# EAGLE design DRV_04_25_2017 (EAGLE 6.6.0)
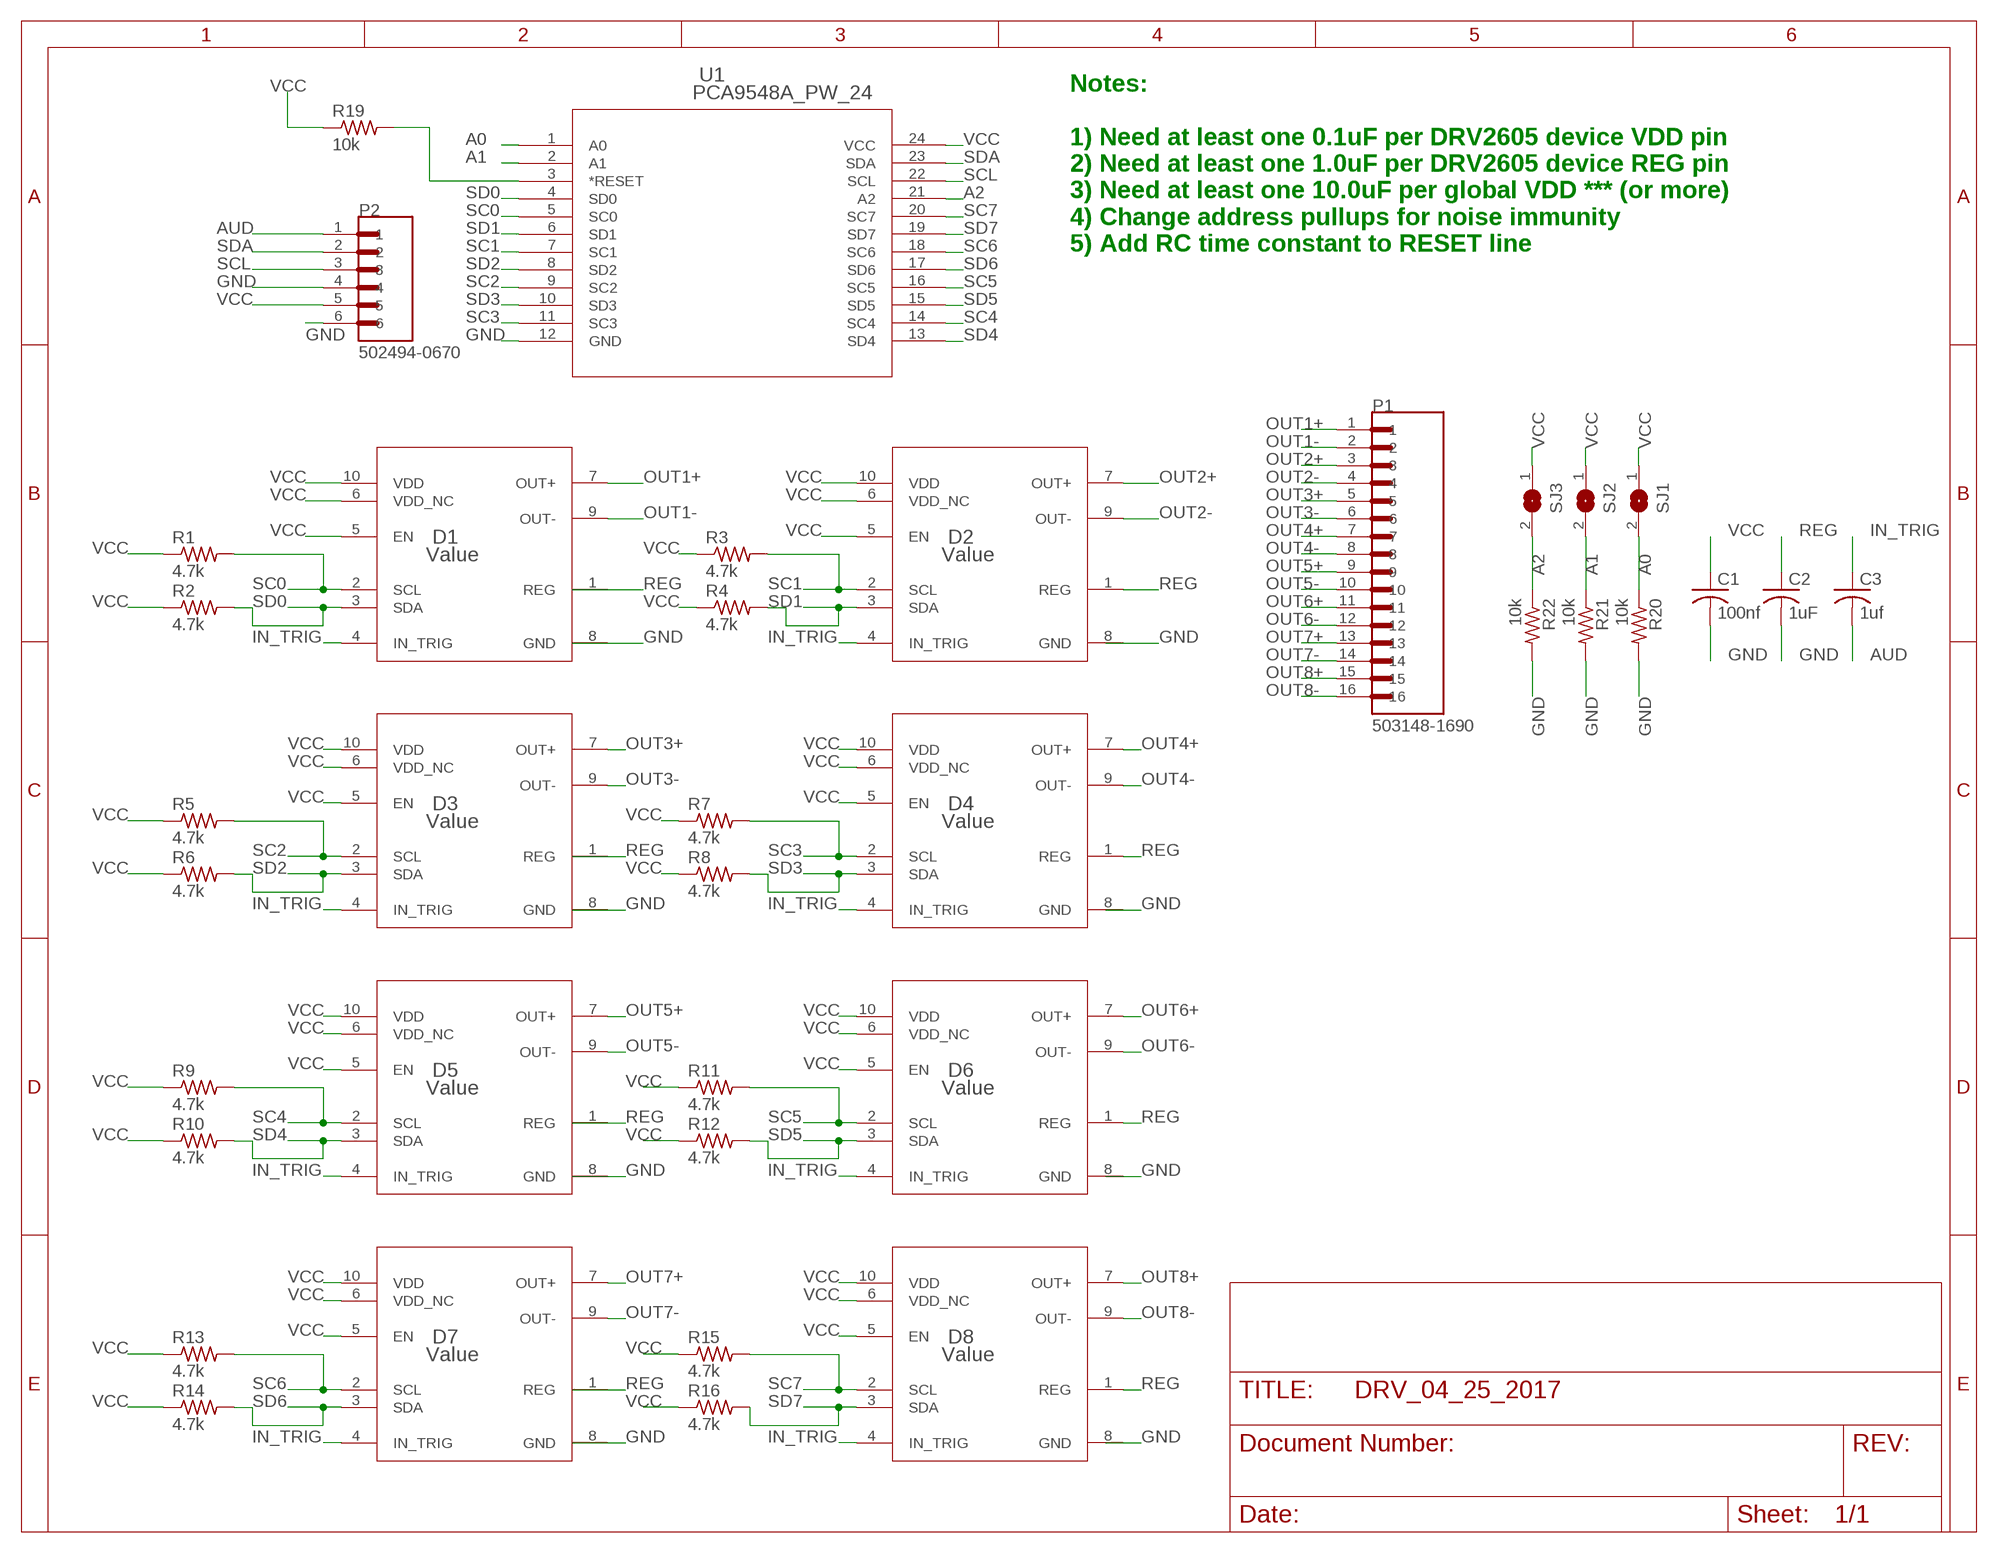
[diagram p0: schematic, sheet 1]

## Parts
C1  100nf  C-USC0603  [C0603]
C2  1uF  C-USC0603  [C0603]
C3  1uf  C-USC0603  [C0603]
D1  Value  DRV2605LDGSR  [DGS0010A]
D2  Value  DRV2605LDGSR  [DGS0010A]
D3  Value  DRV2605LDGSR  [DGS0010A]
D4  Value  DRV2605LDGSR  [DGS0010A]
D5  Value  DRV2605LDGSR  [DGS0010A]
D6  Value  DRV2605LDGSR  [DGS0010A]
D7  Value  DRV2605LDGSR  [DGS0010A]
D8  Value  DRV2605LDGSR  [DGS0010A]
P1  503148-1690  [MOLEX_503148-1690]
P2  502494-0670  [MOLEX_502494-0670]
R1  4.7k  R-US_R0402  [R0402]
R2  4.7k  R-US_R0402  [R0402]
R3  4.7k  R-US_R0402  [R0402]
R4  4.7k  R-US_R0402  [R0402]
R5  4.7k  R-US_R0402  [R0402]
R6  4.7k  R-US_R0402  [R0402]
R7  4.7k  R-US_R0402  [R0402]
R8  4.7k  R-US_R0402  [R0402]
R9  4.7k  R-US_R0402  [R0402]
R10  4.7k  R-US_R0402  [R0402]
R11  4.7k  R-US_R0402  [R0402]
R12  4.7k  R-US_R0402  [R0402]
R13  4.7k  R-US_R0402  [R0402]
R14  4.7k  R-US_R0402  [R0402]
R15  4.7k  R-US_R0402  [R0402]
R16  4.7k  R-US_R0402  [R0402]
R19  10k  R-US_R0402  [R0402]
R20  10k  R-US_R0402  [R0402]
R21  10k  R-US_R0402  [R0402]
R22  10k  R-US_R0402  [R0402]
SJ1  SJ  [SJ]
SJ2  SJ  [SJ]
SJ3  SJ  [SJ]
U1  PCA9548A_PW_24  [PW24]

## Nets
A0: R20.1 SJ1.2 U1.1(A0)
A1: R21.1 SJ2.2 U1.2(A1)
A2: R22.1 SJ3.2 U1.21(A2)
AUD: C3.2 P2.1
GND: C1.2 C2.2 D1.8(GND) D2.8(GND) D3.8(GND) D4.8(GND) D5.8(GND) D6.8(GND) D7.8(GND) D8.8(GND) P2.4 P2.6 R20.2 R21.2 R22.2 U1.12(GND)
IN_TRIG: C3.1 D1.4(IN_TRIG) D2.4(IN_TRIG) D3.4(IN_TRIG) D4.4(IN_TRIG) D5.4(IN_TRIG) D6.4(IN_TRIG) D7.4(IN_TRIG) D8.4(IN_TRIG)
OUT1+: D1.7(OUT+) P1.1
OUT1-: D1.9(OUT-) P1.2
OUT2+: D2.7(OUT+) P1.3
OUT2-: D2.9(OUT-) P1.4
OUT3+: D3.7(OUT+) P1.5
OUT3-: D3.9(OUT-) P1.6
OUT4+: D4.7(OUT+) P1.7
OUT4-: D4.9(OUT-) P1.8
OUT5+: D5.7(OUT+) P1.9
OUT5-: D5.9(OUT-) P1.10
OUT6+: D6.7(OUT+) P1.11
OUT6-: D6.9(OUT-) P1.12
OUT7+: D7.7(OUT+) P1.13
OUT7-: D7.9(OUT-) P1.14
OUT8+: D8.7(OUT+) P1.15
OUT8-: D8.9(OUT-) P1.16
REG: C2.1 D1.1(REG) D2.1(REG) D3.1(REG) D4.1(REG) D5.1(REG) D6.1(REG) D7.1(REG) D8.1(REG)
RESET: R19.2 U1.3(*RESET)
SC0: D1.2(SCL) R1.2 U1.5(SC0)
SC1: D2.2(SCL) R3.2 U1.7(SC1)
SC2: D3.2(SCL) R5.2 U1.9(SC2)
SC3: D4.2(SCL) R7.2 U1.11(SC3)
SC4: D5.2(SCL) R9.2 U1.14(SC4)
SC5: D6.2(SCL) R11.2 U1.16(SC5)
SC6: D7.2(SCL) R13.2 U1.18(SC6)
SC7: D8.2(SCL) R15.2 U1.20(SC7)
SCL: P2.3 U1.22(SCL)
SD0: D1.3(SDA) R2.2 U1.4(SD0)
SD1: D2.3(SDA) R4.2 U1.6(SD1)
SD2: D3.3(SDA) R6.2 U1.8(SD2)
SD3: D4.3(SDA) R8.2 U1.10(SD3)
SD4: D5.3(SDA) R10.2 U1.13(SD4)
SD5: D6.3(SDA) R12.2 U1.15(SD5)
SD6: D7.3(SDA) R14.2 U1.17(SD6)
SD7: D8.3(SDA) R16.2 U1.19(SD7)
SDA: P2.2 U1.23(SDA)
VCC: C1.1 D1.5(EN) D1.6(VDD_NC) D1.10(VDD) D2.5(EN) D2.6(VDD_NC) D2.10(VDD) D3.5(EN) D3.6(VDD_NC) D3.10(VDD) D4.5(EN) D4.6(VDD_NC) D4.10(VDD) D5.5(EN) D5.6(VDD_NC) D5.10(VDD) D6.5(EN) D6.6(VDD_NC) D6.10(VDD) D7.5(EN) D7.6(VDD_NC) D7.10(VDD) D8.5(EN) D8.6(VDD_NC) D8.10(VDD) P2.5 R1.1 R2.1 R3.1 R4.1 R5.1 R6.1 R7.1 R8.1 R9.1 R10.1 R11.1 R12.1 R13.1 R14.1 R15.1 R16.1 R19.1 SJ1.1 SJ2.1 SJ3.1 U1.24(VCC)

## Notes on the sheet
- Notes:
  
  1) Need at least one 0.1uF per DRV2605 device VDD pin
  2) Need at least one 1.0uF per DRV2605 device REG pin
  3) Need at least one 10.0uF per global VDD *** (or more)
  4) Change address pullups for noise immunity
  5) Add RC time constant to RESET line

## Library data of the parts
C1-C3 = rcl:C-US: CAPACITOR, American symbol
D1-D8 = DRV2605L_DGSR:DRV2605LDGSR; COMPTYPE: IC; MANUFACTURER: Texas Instruments; MOUNTTYPE: SMT; PACKAGEREFERENCE: DGS0010A; PARTNUMBER: DRV2605LDGS; PIN_COUNT: 10; REFDES: RefDes; ROHS: Y; TYPE: TYPE
P1 = 503148-1690:503148-1690: 1.50mm Pitch CLIK-Mate™ Wire-to-Board PCB Receptacle, Dual Row, Right Angle, 16 Circuits; AVAILABILITY: Good; DESCRIPTION: 1.50mm Pitch CLIK-Mate™ Wire-to-Board PCB Receptacle, Dual Row, Right Angle, 16 Circuits; MF: Molex; MP: 503148-1690; PACKAGE: None; PRICE: 1.51 USD
P2 = 502494-0670:502494-0670: 2.00mm Pitch CLIK-Mate™ Wire-to-Board PCB Receptacle, Single Row, Right Angle, 6 Circuits; AVAILABILITY: Good; DESCRIPTION: 2.00mm Pitch CLIK-Mate™ Wire-to-Board PCB Receptacle, Single Row, Right Angle, 6 Circuits; MF: Molex; MP: 502494-0670; PACKAGE: None; PRICE: 0.53 USD
R1-R16 R19-R22 = resistor:R-US_: RESISTOR, American symbol
SJ1-SJ3 = jumper:SJ: SMD solder JUMPER
U1 = PCA9548A_PW_124:PCA9548A_PW_24; DATASHEETURL: http://www.ti.com/lit/gpn/PCA9548A; DESCRIPTION: 8-Channel I2C Switch With Reset; FAMILY_NAME: I2C MULTIPLEXER, SWITCH; GENERIC_PART_NUMBER: PCA9548A; INDUSTRY_STD_PKG_TYPE: TSSOP; MANUFACTURER: Texas Instruments; MANUFACTURER_PART_NUMBER: pca9548a_pw_24; PACKAGE_DESIGNATOR: PW; PIN_COUNT: 24; VENDOR: Texas Instruments

## Net classes
0 default: width 0.1 mm, drill 0.185 mm, clearance 0.1 mm

## Board
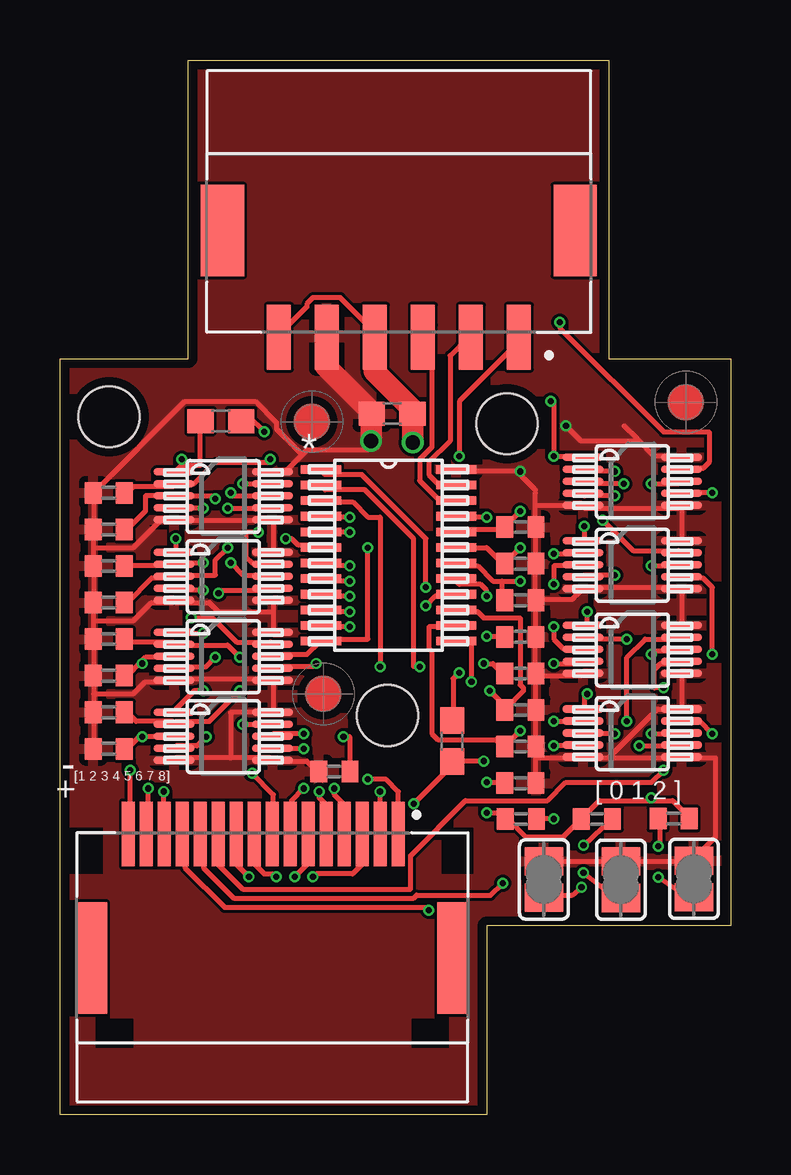
[diagram p1: board, top side]
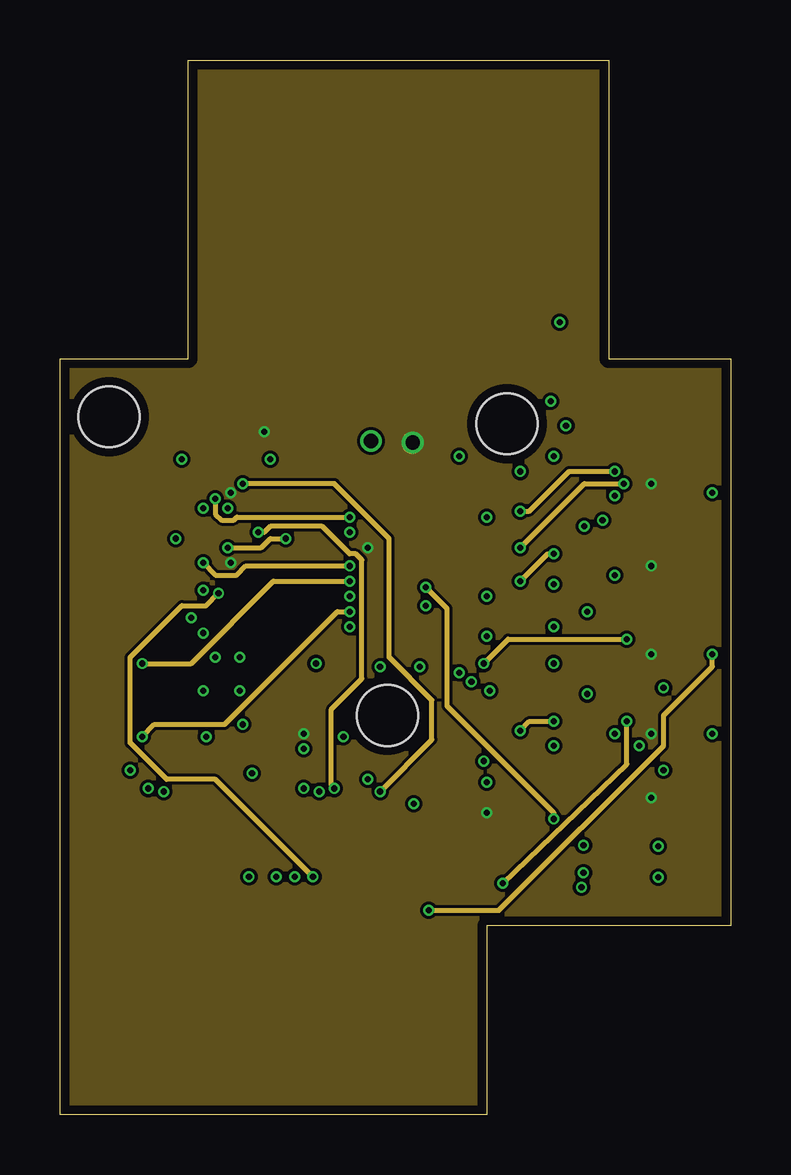
[diagram p2: board, inner layer Route2]
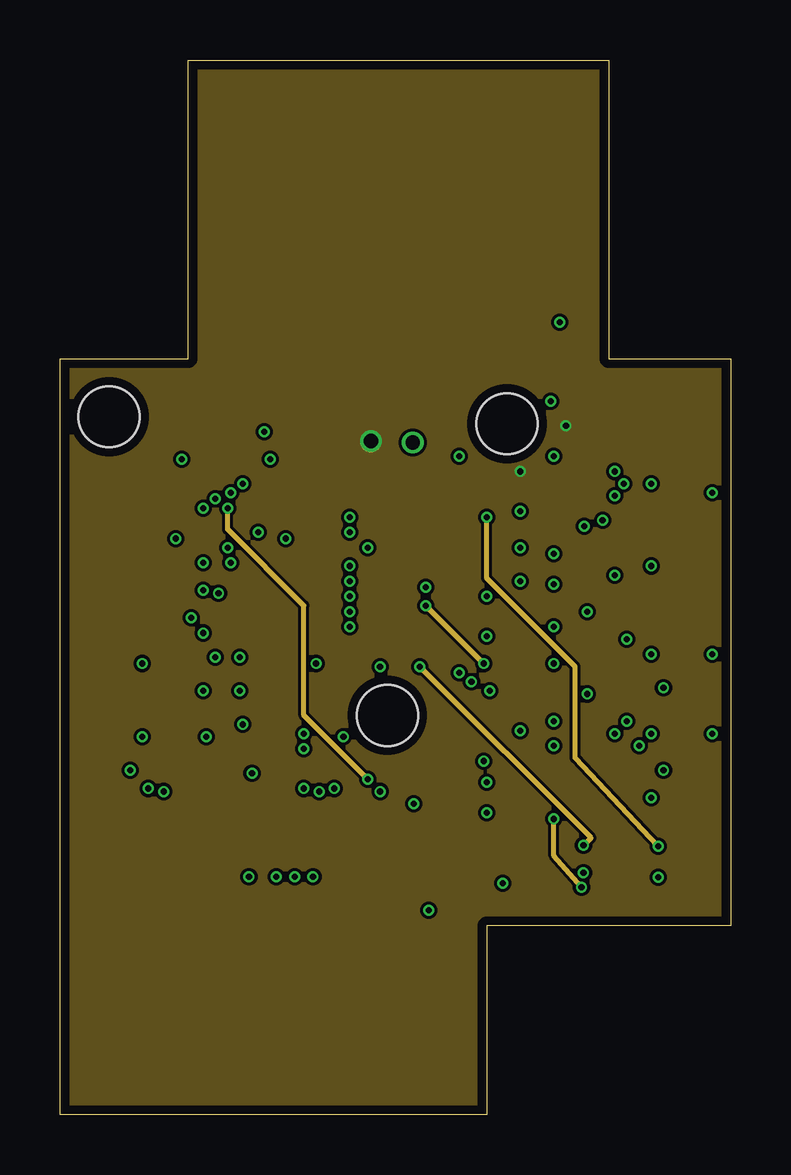
[diagram p3: board, inner layer Route15]
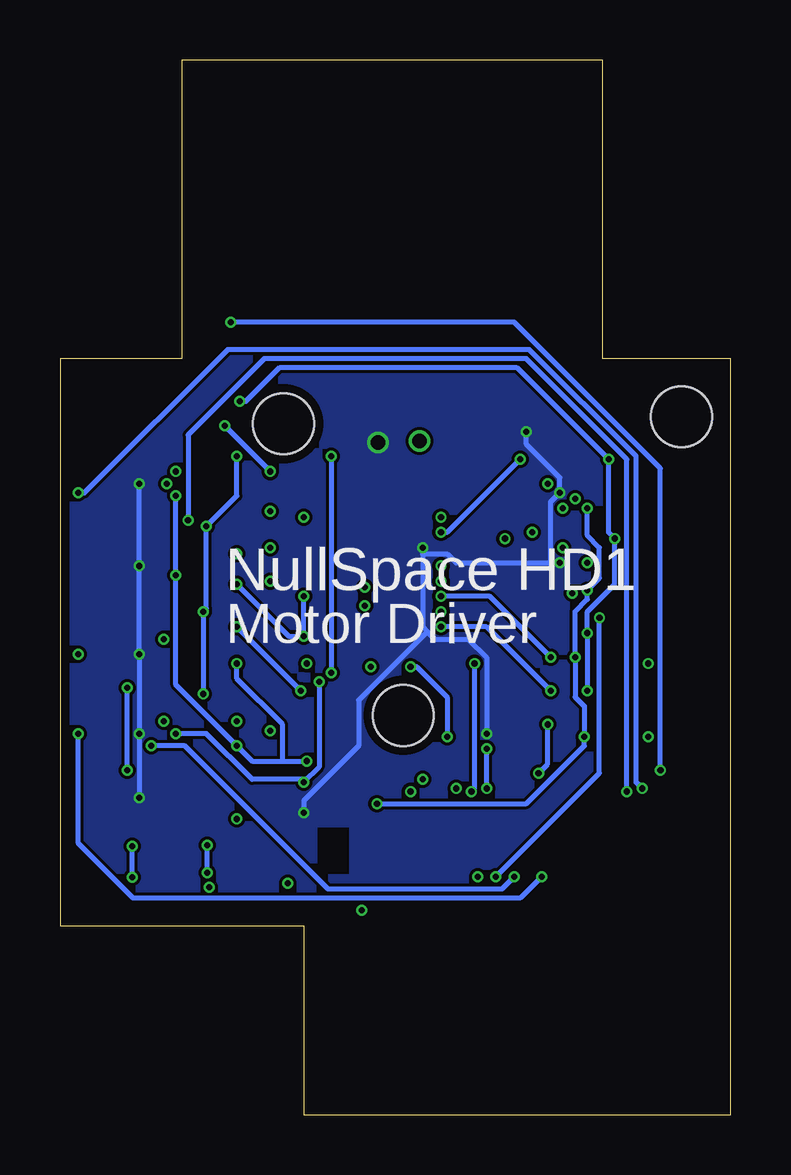
[diagram p4: board, bottom side, seen from below]

Size 27.94 x 43.94 mm. Coordinates in mm from the lower left corner, seen from the top.
Outline: 5.33,31.5 5.33,43.94 22.86,43.94 22.86,31.5 27.94,31.5 27.94,7.87 17.78,7.87 17.78,0 0,0 0,31.5 5.33,31.5
Copper layers (1*2*15*16): Top 0.035559375mm / dielectric 0.17018125mm / Route2 0.01778125mm / dielectric 47mil / Route15 0.01778125mm / dielectric 0.17018125mm / Bottom 0.035559375mm
Design rules "OSHPark-4layer *": minimum track width 8mil, minimum drill 10mil, track to track 5mil, track to pad 5mil, pad to pad 5mil, via to via 5mil, smd to smd 5mil, copper to edge 15mil, drill to drill 6mil, minimum pad ring 4mil, minimum via ring 4mil, stop-mask expansion 2.5mil, vias tented up to drill 0mil, thermal gap 10mil
Holes 2.54 mm at 2.05,29.08 18.63,28.79 13.64,16.64

### Footprints (pad centres in the part's own frame; a part is rotated, then mirrored left to right if it is on the bottom)
C0603 = smd 1.1 x 1: 1 -0.85,0; 2 0.85,0
DGS0010A = smd 1.702 x 0.305: 1 -2.05,1; 2 -2.05,0.5; 3 -2.05,0; 4 -2.05,-0.5; 5 -2.05,-1; 6 2.05,-1; 7 2.05,-0.5; 8 2.05,0; 9 2.05,0.5; 10 2.05,1
MOLEX_503148-1690 = smd 0.55 x 2.7: 1 5.25,0; 2 4.5,0; 3 3.75,0; 4 3,0; 5 2.25,0; 6 1.5,0; 7 0.75,0; 8 0,0; 9 -0.75,0; 10 -1.5,0; 11 -2.25,0; 12 -3,0; 13 -3.75,0; 14 -4.5,0; 15 -5.25,0; 16 -6,0 | smd 1.2 x 4.65: P1 7.48,-5.175; P2 -7.48,-5.175
MOLEX_502494-0670 = smd 1 x 2.7: 1 -5,0; 2 -3,0; 3 -1,0; 4 1,0; 5 3,0; 6 5,0 | smd 1.8 x 3.8: P1 -7.35,-4.45; P2 7.35,-4.45
R0402 = smd 0.7 x 0.9: 1 -0.65,0; 2 0.65,0
SJ = smd 1.168 x 1.6: 1 -0.762,0; 2 0.762,0
PW24 = smd 1.676 x 0.356: 1 -2.819,3.575; 2 -2.819,2.925; 3 -2.819,2.275; 4 -2.819,1.625; 5 -2.819,0.975; 6 -2.819,0.325; 7 -2.819,-0.325; 8 -2.819,-0.975; 9 -2.819,-1.625; 10 -2.819,-2.275; 11 -2.819,-2.925; 12 -2.819,-3.575; 13 2.819,-3.575; 14 2.819,-2.925; 15 2.819,-2.275; 16 2.819,-1.625; 17 2.819,-0.975; 18 2.819,-0.325; 19 2.819,0.325; 20 2.819,0.975; 21 2.819,1.625; 22 2.819,2.275; 23 2.819,2.925; 24 2.819,3.575

### Placement (x,y rotation side)
C1  13.84,29.2 0 top
C2  6.7,28.9 0 top
C3  16.35,15.57 90 top
D1  6.8,25.78 0 top
D2  6.81,22.44 0 top
D3  6.8,19.1 0 top
D4  6.8,15.77 0 top
D5  23.85,15.9 0 top
D6  23.85,19.38 0 top
D7  23.85,22.91 0 top
D8  23.85,26.39 0 top
P1  8.85,11.7 0 top
P2  14.12,32.39 180 top
R1  2.03,25.91 0 top
R2  2.03,24.38 0 top
R3  2.03,22.86 0 top
R4  2.03,21.34 0 top
R5  2.03,19.81 0 top
R6  2.03,18.29 0 top
R7  2.03,16.76 0 top
R8  2.03,15.24 0 top
R9  19.19,15.34 180 top
R10  19.19,13.81 180 top
R11  19.19,18.38 180 top
R12  19.19,16.86 180 top
R13  19.19,21.43 180 top
R14  19.19,19.91 180 top
R15  19.19,24.48 180 top
R16  19.19,22.96 180 top
R19  11.43,14.3 0 top
R20  19.2,12.32 180 top
R21  22.37,12.32 180 top
R22  25.57,12.34 0 top
SJ1  20.16,9.8 270 top
SJ2  23.37,9.79 270 top
SJ3  26.41,9.82 270 top
U1  13.69,23.31 0 top
U$1  [FIDUCIAL_G15]  10.97,17.53 0 top
U$2  [FIDUCIAL_G15]  10.5,28.87 0 top
U$4  [FIDUCIAL_G15]  26.08,29.69 0 top

### Tracks (layer width: path | path; a pad name or v marks a point on that pad's centre or on a via)
A0  (via drill 0.25)
  Top 0.203: v20.57,12.32 19.94,12.32 R20.1 | v21.73,9.47 21.34,9.14 20.19,9.14 SJ1.2 | v15.24,21.97 15.24,24 12.57,26.67 11.05,26.67 10.92,26.8 U1.1
  Route2 0.203: v15.24,21.97 16.13,21.08 16.13,17.02 20.57,12.57 v20.57,12.32
  Route15 0.203: v20.57,12.32 20.57,10.8 v21.73,9.47
A1  (via drill 0.25)
  Top 0.203: v21.81,11.23 22.99,12.32 R21.1 | v21.81,10.08 22.99,9.14 23.37,9.14 SJ2.2 | v14.99,18.67 14.73,18.67 14.73,24 12.7,26.03 11.05,26.03 10.92,26.16 U1.2
  Route15 0.203: v14.99,18.67 22.13,11.53 v21.81,11.23
  Bottom 0.203: v21.81,10.08 v21.81,11.23
A2  (via drill 0.25)
  Top 0.203: v24.93,11.18 25.02,11.18 25.02,12.32 R22.1 | v24.92,9.9 26.04,9.14 26.29,9.14 SJ3.2 | v17.78,24.89 16.51,24.89 U1.21
  Route15 0.203: v17.78,24.89 17.78,22.35 21.46,18.67 21.46,14.86 v24.93,11.18
  Bottom 0.203: v24.92,9.9 v24.93,11.18
AUD  (via drill 0.25)
  Top 0.203: v16.64,18.42 16.38,18.16 16.38,16.51 C3.2 | v16.64,27.43 16.64,29.72 19.05,32.13 19.05,32.39 P2.1
  Bottom 0.203: v16.64,27.43 v16.64,18.42
GND  (via drill 0.25, 0.6)
  Top 0.203: 24.64,13.08 22.48,13.08 21.84,12.45 R21.2 20.96,11.56 19.43,11.56 18.67,12.32 R20.2 18.54,12.45 18.42,12.57 v17.78,12.57 | 24.64,13.08 25.53,13.08 26.16,12.45 R22.2 | v24.64,15.88 25.78,15.88 D5.8 | v24.64,19.18 24.77,19.3 25.78,19.3 D6.8 | v24.64,22.86 25.78,22.86 D7.8 | v24.64,26.29 25.78,26.29 D8.8 | v24.64,13.21 24.64,13.08 | 7.62,28.96 C2.2 7.87,29.08 v8.51,28.45 | D3.8 8.89,19.18 10.29,19.18 10.79,19.69 U1.12 10.92,19.81 12.83,19.81 v12.83,23.62 | v10.16,15.88 8.89,15.88 D4.8 | v7.11,22.99 7.62,22.48 8.76,22.48 D2.8 | D1.8 7.24,25.78 v7.11,25.91 | P2.6 9.14,32.51 10.29,33.66 10.29,33.78 10.54,34.04 11.68,34.04 12.95,32.77 P2.4
  Top 0.889: 13.09,30.98 P2.4 13.13,32.38 13.1,30.97 14.69,29.38 C1.2 14.7,29.19 v14.7,28
  Route2 0.889: v14.7,28 14.68,27.98 14.68,28.01
  Bottom 0.203: v24.64,26.29 v24.64,22.86 v24.64,19.18 v24.64,15.88 v24.64,13.21 | v10.16,15.88 10.16,19.05 10.92,19.81 12.32,19.81 12.64,20.13 | 12.64,20.13 12.83,20.32 12.83,23.37 | v12.83,23.62 12.83,23.37 | 7.49,22.99 11.43,22.99 11.81,23.37 12.83,23.37 | 7.49,22.99 v7.11,22.99 | 7.49,22.99 7.49,25.53 v7.11,25.91 7.11,26.54 8.51,27.94 v8.51,28.45 | v17.78,12.57 17.78,13.08 15.49,15.37 15.49,17.27 12.64,20.13
  pour Route2: -6.1,49.02 34.54,49.02 34.54,-4.32 -6.1,-4.32
  pour Bottom: -6.1,46.48 29.46,46.48 29.46,-1.78 -6.1,-1.78
IN_TRIG  (via drill 0.25)
  Top 0.203: v6.1,15.75 5.71,15.37 4.83,15.37 D4.4 | v6.48,19.05 6.1,18.67 4.83,18.67 D3.4 | v5.97,21.84 4.83,21.84 D2.4 | v5.97,25.27 4.83,25.27 D1.4 | v17.65,14.73 16.38,14.73 C3.1 16.38,14.61 v14.73,12.95 | v20.57,15.37 21.72,15.37 D5.4 | v20.57,18.8 21.72,18.8 D6.4 | v23.11,22.48 21.84,22.48 D7.4 | v23.11,25.78 21.84,25.78 D8.4
  Bottom 0.203: v5.97,25.27 5.97,24.13 5.46,23.62 5.46,22.35 v5.97,21.84 5.97,21.46 6.48,20.95 v6.48,19.05 6.48,17.4 6.1,17.02 v6.1,15.75 6.1,15.37 8.51,12.95 v14.73,12.95 | 18.67,14.73 19.94,14.73 v20.57,15.37 23.11,17.91 v23.11,22.48 v23.11,25.78 | 18.67,14.73 v17.65,14.73 | v20.57,18.8 20.57,18.16 18.67,16.26 18.67,14.73
OUT1+  (via drill 0.25)
  Top 0.203: v6.99,25.27 8.76,25.27 D1.7 | v12.83,13.97 13.59,13.97 14.1,13.46 14.1,11.81 P1.1
  Route15 0.203: v6.99,25.27 6.99,24.38 10.16,21.21 10.16,16.64 v12.83,13.97
OUT1-  (via drill 0.25)
  Top 0.203: v7.62,26.29 8.76,26.29 D1.9 | v13.34,13.46 13.34,11.81 P1.2
  Route2 0.203: v7.62,26.29 11.43,26.29 13.72,24 13.72,19.05 15.49,17.27 15.49,15.62 v13.34,13.46
OUT2+  (via drill 0.25)
  Top 0.203: v6.6,21.72 6.73,21.84 8.76,21.84 D2.7 | v10.54,9.91 10.67,10.03 12.19,10.03 12.57,10.41 12.57,11.68 P1.3
  Route2 0.203: v6.6,21.72 6.1,21.21 5.08,21.21 2.92,19.05 2.92,15.49 4.45,13.97 6.48,13.97 v10.54,9.91
OUT2-  (via drill 0.25)
  Top 0.203: v8.25,24.26 7.75,24.26 7.75,23.24 8,22.99 8.76,22.99 D2.9 | v11.43,13.59 11.43,13.33 11.81,12.95 11.81,11.81 P1.4
  Route2 0.203: v8.25,24.26 8.51,24.26 8.76,24.51 10.92,24.51 12.07,23.37 12.32,23.37 12.57,23.11 12.57,18.16 11.3,16.89 11.3,13.72 v11.43,13.59
OUT3+  (via drill 0.25)
  Top 0.203: v10.67,18.8 10.54,18.67 8.89,18.67 D3.7 | v10.79,13.46 10.79,13.21 11.05,12.95 11.05,11.81 P1.5
  Bottom 0.203: v10.67,18.8 10.67,13.59 v10.79,13.46
OUT3-  (via drill 0.25)
  Top 0.203: v5.46,20.7 6.35,20.7 7.37,19.69 8.76,19.69 D3.9 | v9.78,9.91 10.29,10.41 10.29,11.68 P1.6
  Bottom 0.203: v5.46,20.7 5.46,14.22 v9.78,9.91
OUT4+  (via drill 0.25)
  Top 0.203: v10.16,15.24 8.89,15.24 D4.7 | v10.16,13.59 9.65,13.08 9.65,11.81 P1.7
  Bottom 0.203: v10.16,13.59 v10.16,15.24
OUT4-  (via drill 0.25)
  Top 0.203: v7.62,16.26 8.76,16.26 D4.9 | v8,14.22 8.89,13.33 8.89,11.81 P1.8
  Bottom 0.203: v7.62,16.26 7.62,14.61 v8,14.22
OUT5+  (via drill 0.25)
  Top 0.203: v24.13,15.37 25.78,15.37 D5.7 | v9.02,9.91 8.89,10.03 8.51,10.03 8.13,10.41 8.13,11.68 P1.9
  Bottom 0.203: v24.13,15.37 22.73,15.37 16.76,9.4 9.53,9.4 v9.02,9.91
OUT5-  (via drill 0.25)
  Top 0.203: v27.18,15.88 26.67,16.38 25.91,16.38 D5.9 | v7.87,9.91 7.37,10.41 7.37,11.68 P1.10
  Bottom 0.203: v27.18,15.88 27.18,11.3 24.89,9.02 8.76,9.02 v7.87,9.91
OUT6+  (via drill 0.25)
  Top 0.203: v25.15,17.78 24.77,17.78 24.77,18.54 25.02,18.8 25.78,18.8 D6.7 | v25.15,14.35 24.64,13.84 21.08,13.84 20.32,13.08 16.89,13.08 14.61,10.8 14.61,9.4 7.62,9.4 6.6,10.41 P1.11
  Bottom 0.203: v25.15,14.35 v25.15,17.78
OUT6-  (via drill 0.25)
  Top 0.203: v23.62,16.38 23.62,19.05 24.38,19.81 25.78,19.81 D6.9 | v18.45,9.64 17.93,9.14 14.86,9.14 14.73,9.02 7.24,9.02 5.97,10.29 5.97,11.68 P1.12
  Route2 0.203: v23.62,16.38 23.62,14.61 v18.45,9.64
OUT7+  (via drill 0.25)
  Top 0.203: v27.18,19.18 27.18,21.97 26.8,22.35 25.91,22.35 D7.7 | v15.37,8.51 15.24,8.64 6.86,8.64 5.21,10.29 5.21,11.68 P1.13
  Route2 0.203: v27.18,19.18 27.18,18.67 25.15,16.64 25.15,15.37 18.29,8.51 v15.37,8.51
OUT7-  (via drill 0.25)
  Top 0.203: v22.61,24.77 23.88,23.5 25.78,23.5 D7.9 | v4.32,13.46 4.32,11.81 P1.14
  Bottom 0.203: v22.61,24.77 22.61,28.32 19.43,31.5 8.51,31.5 4.32,27.31 v4.32,13.46
OUT8+  (via drill 0.25)
  Top 0.203: v27.18,25.91 25.91,25.91 D8.7 | v3.68,13.59 3.68,11.81 P1.15
  Bottom 0.203: v27.18,25.91 26.92,25.91 20.96,31.88 8.38,31.88 3.94,27.43 3.94,13.84 v3.68,13.59
OUT8-  (via drill 0.25)
  Top 0.203: v20.83,33.02 20.83,32.77 25.15,28.45 27.05,28.45 27.05,27.18 26.8,26.92 25.91,26.92 D8.9 | v2.92,14.35 2.92,11.81 P1.16
  Bottom 0.203: v20.83,33.02 9.02,33.02 2.92,26.92 v2.92,14.35
REG  (via drill 0.25)
  Top 0.203: v21.97,17.53 21.84,17.53 21.84,17.02 D5.1 | v21.97,20.95 21.97,20.45 21.84,20.45 D6.1 | v21.84,24.51 21.84,24 D7.1 | D8.1 21.72,27.43 v20.57,27.43 20.57,29.72 v20.45,29.72 | 5.08,27.05 5.84,27.05 5.84,28.83 C2.1 | 5.08,27.05 4.83,26.8 D1.1 | v5.97,17.65 5.59,17.65 4.83,16.89 D4.1 | v5.97,20.07 4.83,20.07 D3.1 | v4.83,24 4.83,23.5 D2.1 | v5.08,27.31 5.08,27.05
  Bottom 0.203: v21.97,17.53 v21.97,20.95 21.84,21.08 v21.84,24.51 20.57,25.78 v20.57,27.43 | v5.97,17.65 v5.97,20.07 5.97,20.95 4.83,22.1 v4.83,24 5.08,24.26 v5.08,27.31 8.89,31.11 18.8,31.11 20.19,29.72 v20.45,29.72
RESET  (via drill 0.25)
  Top 0.203: v11.81,15.75 12.07,15.75 12.07,14.35 R19.2 | v13.34,18.67 13.34,24.89 12.83,24.89 12.19,25.53 10.92,25.53 U1.3
  Bottom 0.203: v11.81,15.75 11.81,17.4 13.08,18.67 v13.34,18.67
SC0  (via drill 0.25)
  Top 0.203: R1.2 2.79,25.91 3.05,26.16 4.7,26.16 D1.2 4.83,26.29 5.59,26.29 6.48,27.18 8.64,27.18 v8.76,27.31 | v12.07,24.26 10.92,24.26 U1.5
  Bottom 0.203: v12.07,24.26 11.81,24.26 v8.76,27.31
SC1  (via drill 0.25)
  Top 0.203: R3.2 4.7,22.86 D2.2 4.83,22.99 v5.97,22.99 | v12.07,22.86 10.92,22.86 U1.7
  Route2 0.203: v12.07,22.86 7.75,22.86 7.37,22.48 6.48,22.48 v5.97,22.99
SC2  (via drill 0.25)
  Top 0.203: R5.2 2.79,19.81 2.92,19.69 4.7,19.69 D3.2 4.83,19.56 6.99,19.56 v7.49,19.05 | v12.07,21.59 10.92,21.59 U1.9
  Bottom 0.203: v12.07,21.59 10.03,21.59 v7.49,19.05
SC3  (via drill 0.25)
  Top 0.203: R7.2 2.79,16.76 3.18,16.38 4.7,16.38 D4.2 4.83,16.38 6.22,16.38 v7.49,17.65 | v12.07,20.32 10.92,20.32 U1.11
  Bottom 0.203: v12.07,20.32 10.16,20.32 v7.49,17.65
SC4  (via drill 0.25)
  Top 0.203: U1.14 16.51,20.32 15.37,20.32 15.37,19.43 15.49,19.3 15.49,15.88 15.75,15.62 18.16,15.62 18.42,15.37 R9.2 18.54,15.37 v19.18,16 | v20.57,16.38 21.72,16.38 D5.2
  Route2 0.203: v20.57,16.38 19.56,16.38 v19.18,16
SC5  (via drill 0.25)
  Top 0.203: v17.65,18.8 18.03,18.8 18.42,18.42 R11.2 | v15.24,21.21 15.62,21.59 16.51,21.59 U1.16 | v23.62,19.81 21.84,19.81 D6.2
  Route2 0.203: v23.62,19.81 18.67,19.81 v17.65,18.8
  Route15 0.203: v15.24,21.21 v17.65,18.8
SC6  (via drill 0.25)
  Top 0.203: 18.42,22.22 18.42,21.46 R13.2 | 18.42,22.22 18.03,22.22 17.4,22.86 16.51,22.86 U1.18 | v20.57,23.37 21.72,23.37 D7.2 | 18.42,22.22 v19.18,22.22
  Route2 0.203: v20.57,23.37 20.32,23.37 v19.18,22.22
SC7  (via drill 0.25)
  Top 0.203: U1.20 16.51,24.38 18.42,24.38 R15.2 18.54,24.51 v19.18,25.15 | v23.11,26.8 21.84,26.8 D8.2
  Route2 0.203: v23.11,26.8 21.21,26.8 19.56,25.15 v19.18,25.15
SCL
  Top 0.203: U1.22 16.51,25.65 15.75,25.65 14.99,26.42 14.99,27.31 15.49,27.81 15.49,32.89 15.43,32.96
  Top 0.254: 15.49,32.89 15.12,32.89 P2.3
SD0  (via drill 0.25)
  Top 0.203: R2.2 2.79,24.38 3.56,25.15 3.56,25.78 D1.3 6.35,25.78 v6.48,25.65 | v12.07,24.89 10.92,24.89 U1.4
  Route2 0.203: v12.07,24.89 7.37,24.89 7.24,24.77 6.73,24.77 6.48,25.02 v6.48,25.65
SD1  (via drill 0.25)
  Top 0.203: R4.2 2.79,21.34 3.81,22.35 4.7,22.35 D2.3 4.83,22.48 6.48,22.48 6.48,23.11 v6.99,23.62 | v9.4,24 9.65,24 9.91,23.75 10.79,23.75 U1.6
  Route2 0.203: v9.4,24 8.76,24 8.38,23.62 v6.99,23.62
SD2  (via drill 0.25)
  Top 0.203: 3.36,18.86 3.56,19.05 4.7,19.05 D3.3 | 3.36,18.86 2.79,18.29 R6.2 | v12.07,22.22 10.92,22.22 U1.8 | v3.43,18.8 3.36,18.86
  Route2 0.203: v12.07,22.22 8.89,22.22 5.46,18.8 v3.43,18.8
SD3  (via drill 0.25)
  Top 0.203: R8.2 2.79,15.24 3.3,15.75 v3.43,15.75 4.7,15.75 D4.3 | v12.07,20.95 10.92,20.95 U1.10
  Route2 0.203: v12.07,20.95 11.56,20.95 6.86,16.26 3.94,16.26 v3.43,15.75
SD4  (via drill 0.25)
  Top 0.203: v17.78,13.84 18.42,13.84 R10.2 | v17.14,18.03 17.14,19.69 16.51,19.69 U1.13 | v23.11,15.88 21.84,15.88 D5.3
  Bottom 0.203: v17.14,18.03 17.14,14.48 v17.78,13.84 17.78,13.97 19.94,13.97 21.84,15.88 v23.11,15.88
SD5  (via drill 0.25)
  Top 0.203: U1.15 16.51,20.95 17.4,20.95 17.65,20.7 19.18,20.7 19.18,17.91 19.3,17.78 19.3,17.65 18.54,16.89 R12.2 18.54,17.02 v17.91,17.65 | v20.57,20.32 20.57,19.81 20.96,19.43 21.72,19.43 D6.3
  Bottom 0.203: v17.91,17.65 v20.57,20.32
SD6  (via drill 0.25)
  Top 0.203: v17.78,19.94 18.42,19.94 R14.2 | v20.57,22.1 20.57,22.86 21.72,22.86 D7.3 | v17.78,21.59 17.78,21.84 17.53,22.1 16.64,22.1 16.51,22.22 U1.17
  Bottom 0.203: v20.57,22.1 18.42,19.94 v17.78,19.94 v17.78,21.59
SD7  (via drill 0.25)
  Top 0.203: U1.19 17.78,23.62 18.42,22.99 R16.2 18.54,22.99 v19.18,23.62 | v23.5,26.29 21.84,26.29 D8.3
  Route2 0.203: v23.5,26.29 21.84,26.29 v19.18,23.62
SDA
  Top 0.203: U1.23 16.51,26.29 15.75,26.29 15.37,26.67 15.37,27.18 16.26,28.07 16.26,31.62 17.02,32.39 P2.2
VCC  (via drill 0.25, 0.6)
  Top 0.203: D7.10 25.91,24 25.91,25.27 D8.6 25.78,25.27 21.84,25.27 D8.5 21.72,25.4 19.81,25.4 | 19.81,25.4 19.81,24.51 R15.1 19.81,24.38 19.81,22.99 R16.1 19.81,22.86 19.81,21.46 R13.1 | 19.81,25.4 19.81,25.91 | 19.81,26.03 19.11,26.73 | 19.11,26.73 19.05,26.8 16.51,26.8 U1.24 | SJ1.1 20.19,10.54 23.37,10.54 SJ2.1 23.5,10.54 26.29,10.54 SJ3.1 26.42,10.67 27.31,11.56 27.31,14.86 25.91,14.86 D5.6 25.78,14.86 22.86,14.86 | D6.10 25.91,20.45 25.91,21.84 D7.6 25.78,21.97 21.84,21.97 D7.5 21.72,21.84 21.34,21.46 19.94,21.46 R13.1 | D6.6 25.91,18.29 25.91,17.02 D5.10 25.78,16.89 24.89,16.89 22.86,14.86 | R13.1 19.81,21.34 19.81,19.94 R14.1 19.81,19.81 19.81,18.42 R11.1 | 19.81,14.86 19.81,15.24 R9.1 19.81,15.37 19.81,16.76 R12.1 19.81,16.89 19.81,18.29 R11.1 | 19.81,14.86 19.81,13.84 R10.1 | 19.81,14.86 21.72,14.86 D5.5 21.84,14.86 22.86,14.86 | D6.5 21.72,18.29 19.94,18.29 R11.1 | R19.1 10.67,14.35 10.29,14.73 8.89,14.73 D4.6 8.76,14.86 7.11,14.86 | 7.11,14.86 4.83,14.86 D4.5 | D2.10 8.89,23.5 8.89,24.77 D1.6 8.76,24.77 4.83,24.77 D1.5 4.7,24.77 4.19,24.77 3.05,23.62 1.4,23.62 | 8.89,20.95 8.89,21.34 D2.6 | 8.89,20.95 8.89,20.19 D3.10 | 7.11,14.86 7.11,16.76 8.76,16.76 D4.10 8.89,16.89 8.89,18.03 D3.6 8.76,18.16 4.83,18.16 D3.5 4.7,18.03 3.56,18.03 3.05,17.53 1.4,17.53 | 24.07,28.13 24.77,27.43 25.78,27.43 D8.10 | 24.07,28.13 23.5,28.7 | v21.08,28.7 21.72,28.07 24,28.07 24.07,28.13 | v19.18,26.8 19.11,26.73 | 10.1,27.5 10.29,27.69 12.83,27.69 v12.96,28.06 | 10.1,27.5 9.4,26.8 8.89,26.8 D1.10 | 1.4,25.91 1.4,24.38 | 1.4,22.86 1.4,21.34 | 1.4,16.76 1.4,15.24 R8.1 | 1.4,19.81 1.4,18.29
  Top 0.203: 1.4,18.29 1.4,17.53 | 1.4,17.53 1.4,16.76 | 1.4,16.76 R7.1 | 1.4,18.29 R6.1 | 1.4,19.81 1.4,20.57 | 1.4,20.57 1.4,21.34 | 1.4,21.34 R4.1 | 1.4,19.81 R5.1 | 1.4,22.86 1.4,23.62 | 1.4,23.62 1.4,24.38 | 1.4,24.38 R2.1 | 1.4,22.86 R3.1 | 1.4,20.57 3.05,20.57 3.81,21.34 4.7,21.34 D2.5 4.83,21.34 6.22,21.34 6.6,20.95 8.89,20.95 | 10.1,27.5 9.02,28.58 9.02,28.83 8.13,29.72 5.21,29.72 1.4,25.91 | 1.4,25.91 R1.1
  Top 0.889: P2.5 11.06,32.33 11.06,31.2 12.99,29.27 C1.1 12.96,29.17 v12.96,28.06
  Route15 0.889: v12.96,28.06 12.96,28.04
  Bottom 0.203: v21.08,28.7 v19.18,26.8
  pour Route15: -3.56,46.48 32,46.48 32,-1.78 -3.56,-1.78
  pour Top: -3.56,46.48 29.46,46.48 29.46,-1.78 -3.56,-1.78

### Text on the board
tNames: - | [1 2 3 4 5 6 7 8] | + | [ 0 1 2 ]
bNames: NullSpace HD1 | Motor Driver